# EAGLE design P2N15-001 (EAGLE 7.1.0)
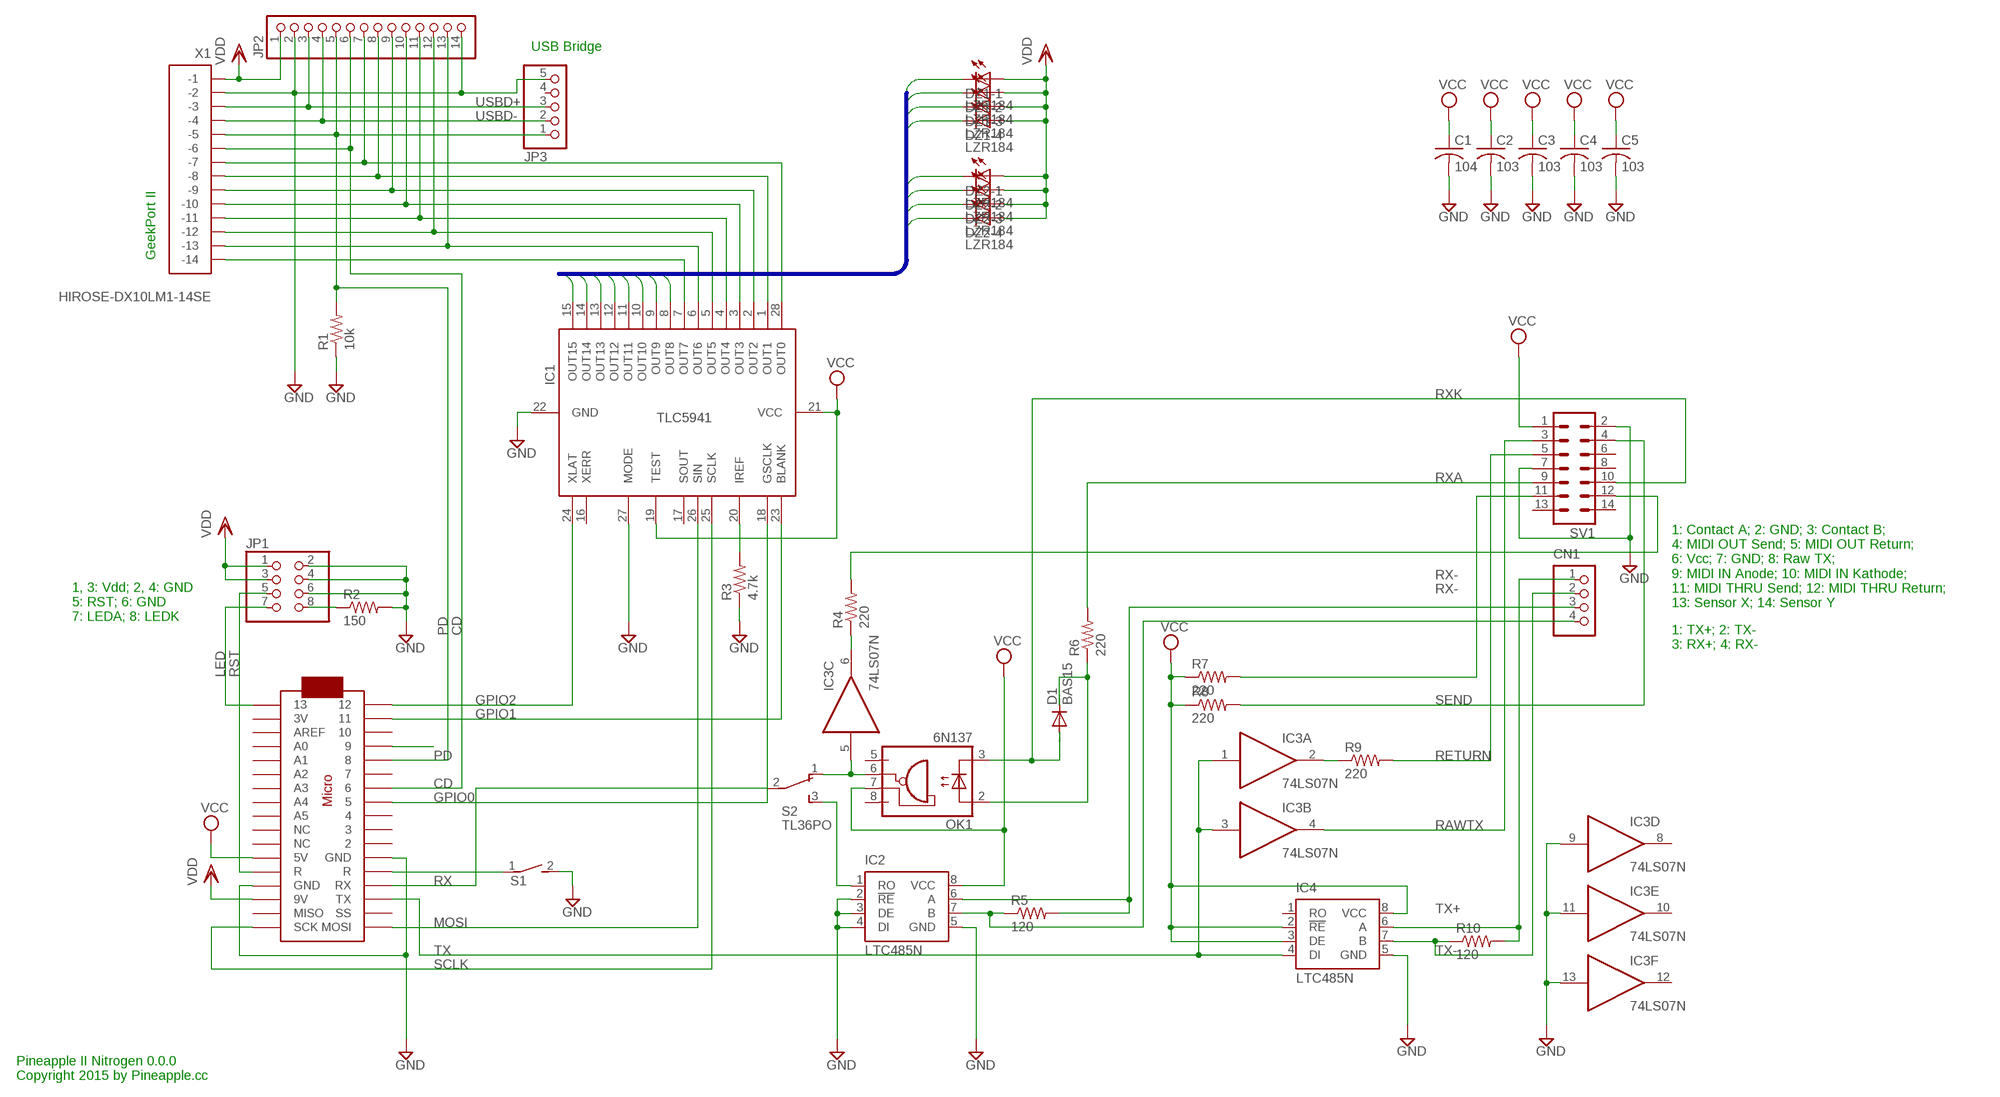
[diagram p0: schematic, sheet 1]

## Parts
C1  104  C-US025-025X050  [C025-025X050]
C2  103  C-US025-025X050  [C025-025X050]
C3  103  C-US025-025X050  [C025-025X050]
C4  103  C-US025-025X050  [C025-025X050]
C5  103  C-US025-025X050  [C025-025X050]
CN1  S4B-PH-K-S  [S4B-PH-K-S]
D1  BAS15  [DO34-7]
DZ1  LZR184  [LZR184]
DZ2  LZR184  [LZR184]
IC1  TLC5941NT  [DIL28-3]
IC2  LTC485N  [DIL08]
IC3  74LS07N  [DIL14]
IC4  LTC485N  [DIL08]
JP1  PINHD-2X4  [2X04]
JP2  PINHD-1X14  [1X14]
JP3  PINHD-1X5/90  [1X05/90]
MC1  ARDUINOMICRO  [ARDUINOMICRO]
OK1  6N137  [DIL08]
R1  10k  R-US_0204/5  [0204/5]
R2  150  R-US_0204/5  [0204/5]
R3  4.7k  R-US_0204/5  [0204/5]
R4  220  R-US_0204/5  [0204/5]
R5  120  R-US_0204/5  [0204/5]
R6  220  R-US_0204/5  [0204/5]
R7  220  R-US_0204/5  [0204/5]
R8  220  R-US_0204/5  [0204/5]
R9  220  R-US_0204/5  [0204/5]
R10  120  R-US_0204/5  [0204/5]
S1  DS01E  [DS-01]
S2  TL36PO  [TL3XPO]
SV1  ML14L  [ML14L]
X1  HIROSE-DX10LM1-14SE  [HIROSE-DX10LM1-14SE]

## Nets
ANLG0: IC1.1(OUT1) JP2.8 X1.P$8(-8)
ANLG1: IC1.2(OUT2) JP2.9 X1.P$9(-9)
ANLG2: IC1.3(OUT3) JP2.10 X1.P$10(-10)
ANLG3: IC1.4(OUT4) JP2.11 X1.P$11(-11)
CD: JP2.6 MC1.P$7 X1.P$6(-6)
GND: C1.2 C2.2 C3.2 C4.2 C5.2 IC1.22(GND) IC1.27(MODE) IC2.2(!RE) IC2.3(DE) IC2.4(DI) IC2.5(GND) IC3.9(D:I) IC3.11(E:I) IC3.13(F:I) IC4.5(GND) JP1.2 JP1.4 JP1.6 JP2.2 JP2.14 JP3.5 MC1.P$12(GND) MC1.P$21(GND) R1.1 R2.2 R3.1 S1.2 SV1.2 SV1.7 X1.P$2(-2)
GPIO0: IC1.18(GSCLK) MC1.P$8
GPIO1: IC1.23(BLANK) MC1.P$2
GPIO2: IC1.24(XLAT) MC1.P$1
LED: JP1.7 MC1.P$34
LED0: DZ1.K1(-1:C) IC1.8(OUT8)
LED1: DZ1.K2(-2:C) IC1.9(OUT9)
LED2: DZ1.K3(-3:C) IC1.10(OUT10)
LED3: DZ1.K4(-4:C) IC1.11(OUT11)
LED4: DZ2.K1(-1:C) IC1.12(OUT12)
LED5: DZ2.K2(-2:C) IC1.13(OUT13)
LED6: DZ2.K3(-3:C) IC1.14(OUT14)
LED7: DZ2.K4(-4:C) IC1.15(OUT15)
MIDIRX: IC3.5(C:I) OK1.6(VO) S2.1(O)
MOSI: IC1.26(SIN) MC1.P$17(MOSI)
N$1: IC1.28(OUT0) JP2.7 X1.P$7(-7)
N$2: IC3.2(A:O) R9.1
N$3: MC1.P$4
N$4: IC1.20(IREF) R3.2
N$5: MC1.P$22(R) S1.1
N$6: IC3.6(C:O) R4.1
N$7: R7.2 SV1.11
N$8: IC1.7(OUT7) X1.P$14(-14)
N$10: R4.2 SV1.12
N$15: D1.C OK1.2(A) R6.1
N$28: IC1.5(OUT5) JP2.12 X1.P$12(-12)
N$29: IC1.6(OUT6) JP2.13 X1.P$13(-13)
N$32: JP1.8 R2.1
PD: JP2.5 JP3.1 MC1.P$5 R1.2 X1.P$5(-5)
RAWTX: IC3.4(B:O) SV1.3
RETURN: R9.2 SV1.5
RST: JP1.5 MC1.P$13(R)
RX: MC1.P$14(RX) S2.2(P)
RX+: CN1.3 IC2.6(A) R5.2
RX-: CN1.4 IC2.7(B) R5.1
RXA: R6.2 SV1.9
RXK: D1.A OK1.3(C) SV1.10
SCLK: IC1.25(SCLK) MC1.P$18(SCK)
SEND: R8.2 SV1.4
TX: IC3.1(A:I) IC3.3(B:I) IC4.4(DI) MC1.P$15(TX)
TX+: CN1.1 IC4.6(A) R10.2
TX-: CN1.2 IC4.7(B) R10.1
USBD+: JP2.3 JP3.3 X1.P$3(-3)
USBD-: JP2.4 JP3.2 X1.P$4(-4)
VCC: C1.1 C2.1 C3.1 C4.1 C5.1 IC1.19(TEST) IC1.21(VCC) IC2.8(VCC) IC4.2(!RE) IC4.3(DE) IC4.8(VCC) MC1.P$23(5V) OK1.7(VE) R7.1 R8.1 SV1.1
VDD: DZ1.A1(-1:A) DZ1.A2(-2:A) DZ1.A3(-3:A) DZ1.A4(-4:A) DZ2.A1(-1:A) DZ2.A2(-2:A) DZ2.A3(-3:A) DZ2.A4(-4:A) JP1.1 JP1.3 JP2.1 MC1.P$20(9V) X1.P$1(-1)
XMIDIRX: IC2.1(RO) S2.3(S)
Unconnected: IC1.16(XERR) IC1.17(SOUT) IC3.8(D:O) IC3.10(E:O) IC3.12(F:O) IC4.1(RO) JP3.4 MC1.P$3 MC1.P$6 MC1.P$9 MC1.P$10 MC1.P$11 MC1.P$16(SS) MC1.P$19(MISO) MC1.P$24(NC) MC1.P$25(NC) MC1.P$26(A5) MC1.P$27(A4) MC1.P$28(A3) MC1.P$29(A2) MC1.P$30(A1) MC1.P$31(A0) MC1.P$32(AREF) MC1.P$33(3V) OK1.5(GND) OK1.8(VCC) SV1.6 SV1.8 SV1.13 SV1.14

## Buses
LED[0..7]

## Notes on the sheet
- USB Bridge
- GeekPort II
- 1: Contact A; 2: GND; 3: Contact B;
  4: MIDI OUT Send; 5: MIDI OUT Return;
  6: Vcc; 7: GND; 8: Raw TX;
  9: MIDI IN Anode; 10: MIDI IN Kathode;
  11: MIDI THRU Send; 12: MIDI THRU Return;
  13: Sensor X; 14: Sensor Y
- 1, 3: Vdd; 2, 4: GND
  5: RST; 6: GND
  7: LEDA; 8: LEDK
- 1: TX+; 2: TX-
  3: RX+; 4: RX-
- Pineapple II Nitrogen 0.0.0
  Copyright 2015 by Pineapple.cc

## Power pins joined to a net without a drawn wire
GND: IC3.7(P:GND)
VCC: IC3.14(P:VCC)

## Library data of the parts
C1-C5 = rcl:C-US: CAPACITOR, American symbol
CN1 = jst-ph:S4B-PH-*: Wire-to-Board 2.0mm pitch side mount connector Source: http://www.jst-mfg.com/product/pdf/jpn/PH.pdf http://www.jst-mfg.com/product/detail.php?series=199
D1 = diode:BAS15: DIODE high speed
DZ1 DZ2 = led:LZR184: LED BLOCK 4 LEDs, Siemens
IC1 = adafruit:TLC5941
IC2 IC4 = linear-technology:LTC485: Low Power RS485 Interface Transceiver Source: http://www.linear.com/pc/downloadDocument.do?navId=H0,C1,C1007,C1017,P2064,D1718; OC_FARNELL: unknown; OC_NEWARK: unknown
IC3 = 74xx-us:74*07: Hex BUFFER, open collector high-voltage output
JP1 = pinhead:PINHD-2X4: PIN HEADER
JP2 = pinhead:PINHD-1X14: PIN HEADER
JP3 = pinhead:PINHD-1X5: PIN HEADER
MC1 = adafruit:ARDUINOMICRO
OK1 = optocoupler:6N137: MOTOROLA OPTO COUPLER; MPN: 6N137; OC_FARNELL: 1328376; OC_NEWARK: 52M1895
R1-R10 = resistor:R-US_: RESISTOR, American symbol
S1 = switch-dil:DS01E: DIL/CODE SWITCH; OC_FARNELL: unknown; OC_NEWARK: unknown
S2 = switch:TL36PO: TINY SWITCH ON - ON Source: http://www2.produktinfo.conrad.com/datenblaetter/700000-724999/705152-da-01-de-Subminiaturschalter_TL_36YO.pdf
SV1 = con-ml:ML14L: HARTING; OC_FARNELL: unknown; OC_NEWARK: unknown
X1 = con-hirose-dx10lm1-14se:HIROSE-DX10LM1-14SE: AXR30545 Plug (Board mounting type) B type Source: http://www.panasonic-electric-works.ch/home/www/catalogues/connector/download/en_ds_65201_0000.pdf; MPN: AXR30545; OC_FARNELL: unknown; OC_NEWARK: 11N4069

## Board
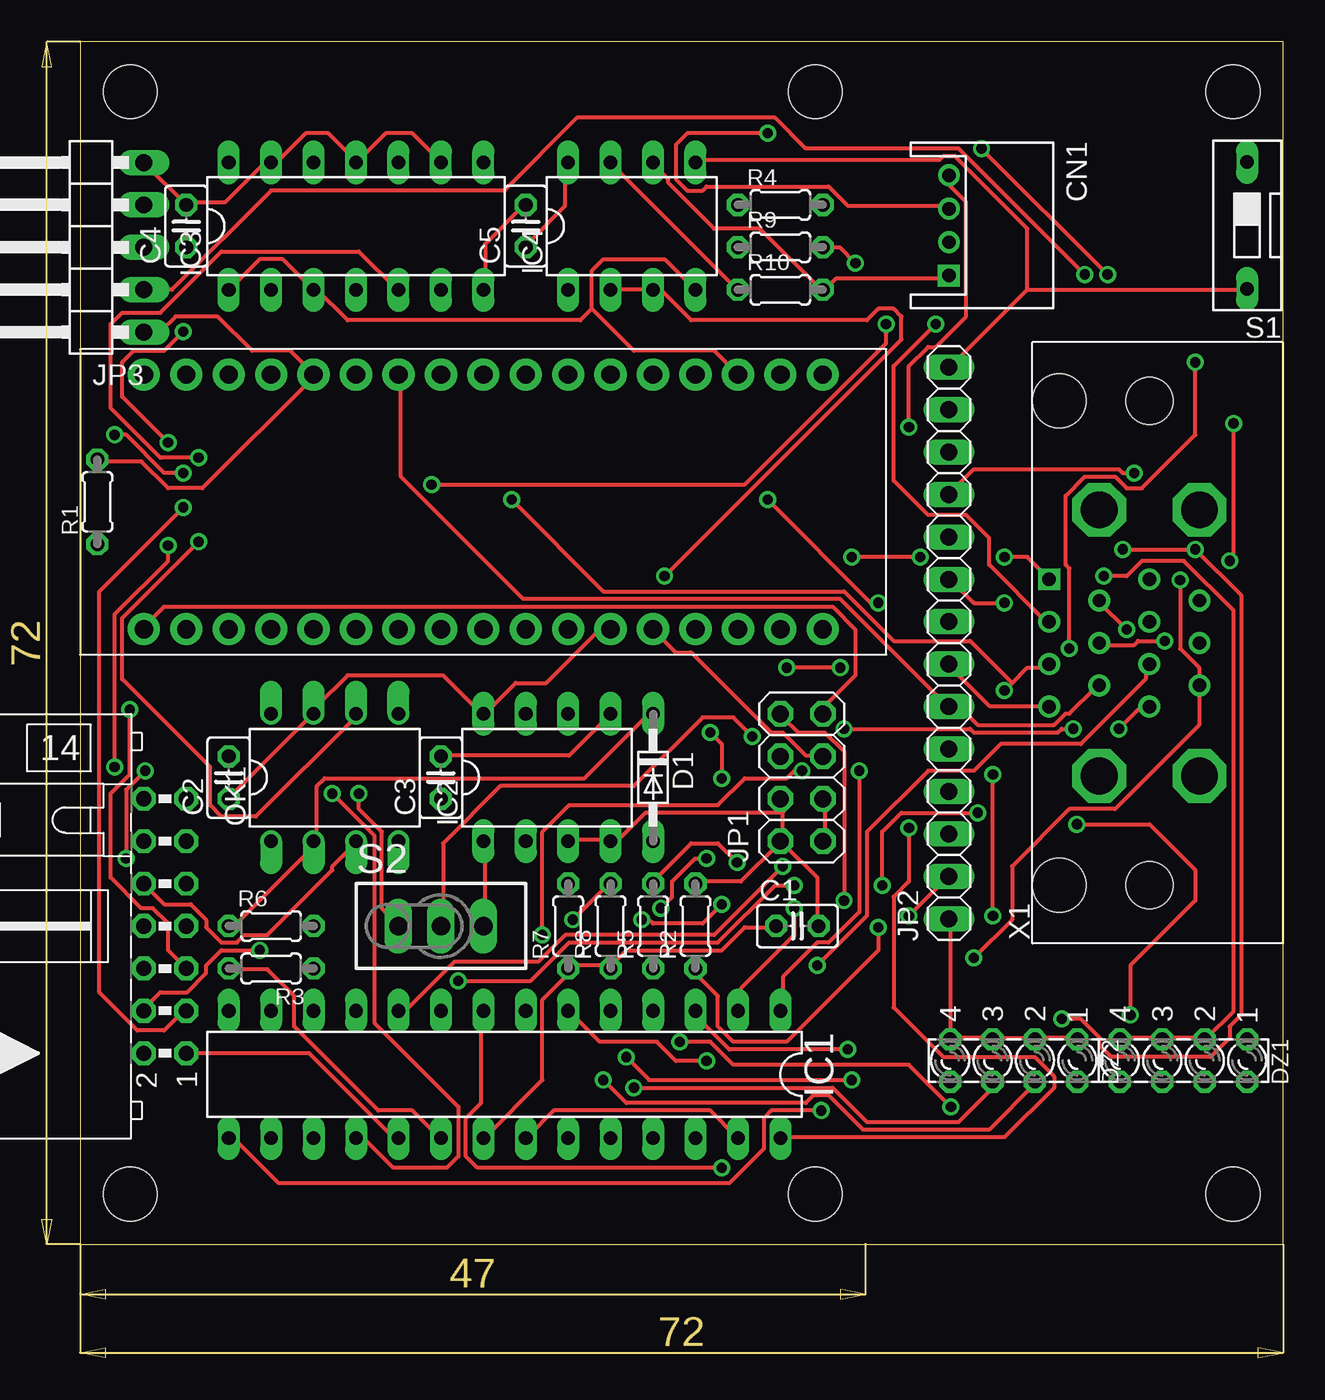
[diagram p1: board, top side]
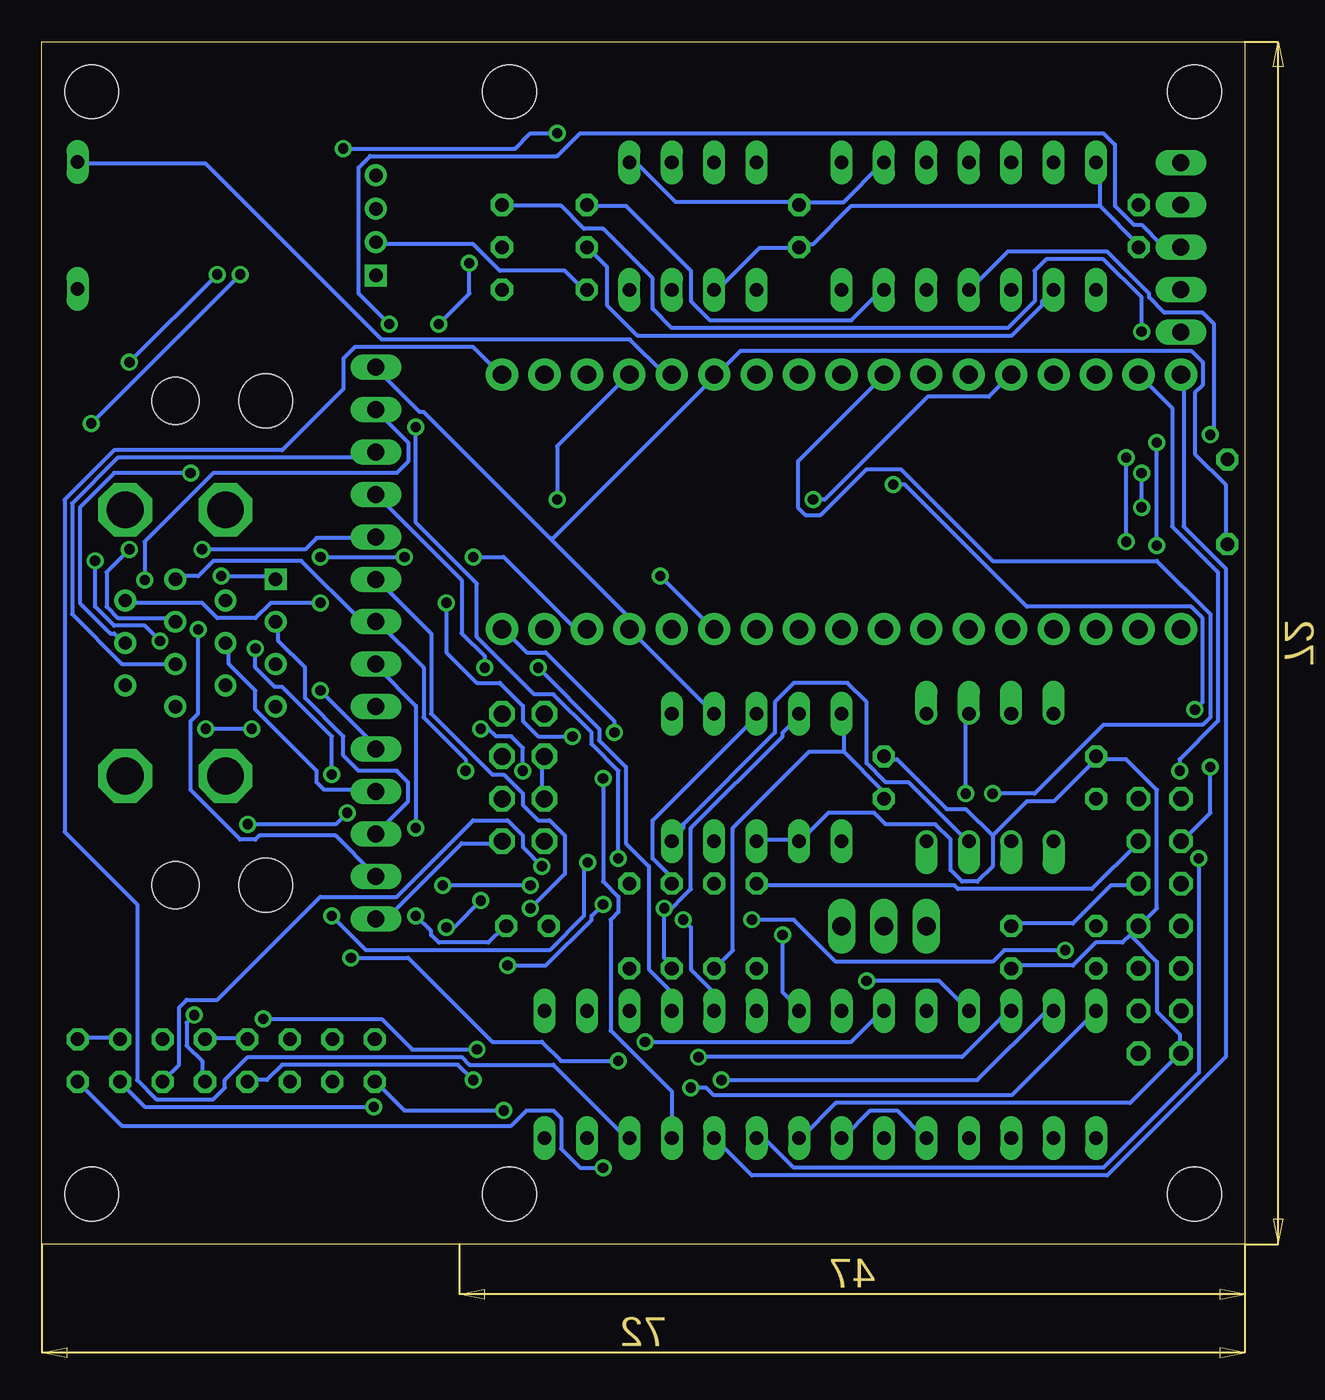
[diagram p2: board, bottom side, seen from below]

Size 72 x 72 mm. Coordinates in mm from the lower left corner, seen from the top.
Outline: 0,0 72,0 72,72 0,72 0,0
Copper layers (1*16): Top 0.035mm / dielectric 1.5mm / Bottom 0.035mm
Design rules "default": minimum track width 10mil, minimum drill 24mil, track to track 8mil, track to pad 8mil, pad to pad 8mil, via to via 8mil, smd to smd 8mil, copper to edge 40mil, drill to drill 8mil, minimum pad ring 10mil, minimum via ring 8mil, stop-mask expansion 4mil, vias tented up to drill 0mil, thermal gap 10mil
Holes 3.2 mm at 3,3 3,69 69,3 69,69 44,3 44,69

### Footprints (pad centres in the part's own frame; a part is rotated, then mirrored left to right if it is on the bottom)
C025-025X050 = drill 0.813 octagon: 1 -1.27,0; 2 1.27,0
S4B-PH-K-S = drill 0.8 square: 1 3,0 | drill 0.8: 2 1,0; 3 -1,0; 4 -3,0
DO34-7 = drill 0.813 long: A 3.81,0; C -3.81,0
LZR184 = drill 0.813 octagon: A1 -1.27,3.81; A2 -1.27,1.27; A3 -1.27,-1.27; A4 -1.27,-3.81; K1 1.27,3.81; K2 1.27,1.27; K3 1.27,-1.27; K4 1.27,-3.81
DIL28-3 = drill 0.813 long: 1 -16.51,-3.81; 2 -13.97,-3.81; 3 -11.43,-3.81; 4 -8.89,-3.81; 5 -6.35,-3.81; 6 -3.81,-3.81; 7 -1.27,-3.81; 8 1.27,-3.81; 9 3.81,-3.81; 10 6.35,-3.81; 11 8.89,-3.81; 12 11.43,-3.81; 13 13.97,-3.81; 14 16.51,-3.81; 15 16.51,3.81; 16 13.97,3.81; 17 11.43,3.81; 18 8.89,3.81; 19 6.35,3.81; 20 3.81,3.81; 21 1.27,3.81; 22 -1.27,3.81; 23 -3.81,3.81; 24 -6.35,3.81; 25 -8.89,3.81; 26 -11.43,3.81; 27 -13.97,3.81; 28 -16.51,3.81
DIL08 = drill 0.813 long: 1 -3.81,-3.81; 2 -1.27,-3.81; 3 1.27,-3.81; 4 3.81,-3.81; 5 3.81,3.81; 6 1.27,3.81; 7 -1.27,3.81; 8 -3.81,3.81
DIL14 = drill 0.813 long: 1 -7.62,-3.81; 2 -5.08,-3.81; 3 -2.54,-3.81; 4 0,-3.81; 5 2.54,-3.81; 6 5.08,-3.81; 7 7.62,-3.81; 8 7.62,3.81; 9 5.08,3.81; 10 2.54,3.81; 11 0,3.81; 12 -2.54,3.81; 13 -5.08,3.81; 14 -7.62,3.81
2X04 = drill 1.016 octagon: 1 -3.81,-1.27; 2 -3.81,1.27; 3 -1.27,-1.27; 4 -1.27,1.27; 5 1.27,-1.27; 6 1.27,1.27; 7 3.81,-1.27; 8 3.81,1.27
1X14 = drill 1.016 long: 1 -16.51,0; 2 -13.97,0; 3 -11.43,0; 4 -8.89,0; 5 -6.35,0; 6 -3.81,0; 7 -1.27,0; 8 1.27,0; 9 3.81,0; 10 6.35,0; 11 8.89,0; 12 11.43,0; 13 13.97,0; 14 16.51,0
1X05/90 = drill 1.016 long: 1 -5.08,-3.81; 2 -2.54,-3.81; 3 0,-3.81; 4 2.54,-3.81; 5 5.08,-3.81
ARDUINOMICRO = drill 1.1 pad 1.93: P$1 -20.32,7.62; P$2 -17.78,7.62; P$3 -15.24,7.62; P$4 -12.7,7.62; P$5 -10.16,7.62; P$6 -7.62,7.62; P$7 -5.08,7.62; P$8 -2.54,7.62; P$9 0,7.62; P$10 2.54,7.62; P$11 5.08,7.62; P$12 12.7,-7.62; P$13 10.16,-7.62; P$14 12.7,7.62; P$15 15.24,7.62; P$16 17.78,7.62; P$17 20.32,7.62; P$18 20.32,-7.62; P$19 17.78,-7.62; P$20 15.24,-7.62; P$21 7.62,7.62; P$22 10.16,7.62; P$23 7.62,-7.62; P$24 5.08,-7.62; P$25 2.54,-7.62; P$26 0,-7.62; P$27 -2.54,-7.62; P$28 -5.08,-7.62; P$29 -7.62,-7.62; P$30 -10.16,-7.62; P$31 -12.7,-7.62; P$32 -15.24,-7.62; P$33 -17.78,-7.62; P$34 -20.32,-7.62
DIL08' = drill 0.813 offset: 1 -3.81,-3.81; 2 -1.27,-3.81; 3 1.27,-3.81; 4 3.81,-3.81; 5 3.81,3.81; 6 1.27,3.81; 7 -1.27,3.81; 8 -3.81,3.81
0204/5 = drill 0.813 octagon: 1 -2.54,0; 2 2.54,0
DS-01 = drill 0.813 long: 1 0,-3.81; 2 0,3.81
TL3XPO = drill 1.1 pad 1.422 long: 1 -2.54,0; 2 0,0; 3 2.54,0
ML14L = drill 0.914 octagon: 1 -7.62,-1.27; 2 -7.62,1.27; 3 -5.08,-1.27; 4 -5.08,1.27; 5 -2.54,-1.27; 6 -2.54,1.27; 7 0,-1.27; 8 0,1.27; 9 2.54,-1.27; 10 2.54,1.27; 11 5.08,-1.27; 12 5.08,1.27; 13 7.62,-1.27; 14 7.62,1.27
HIROSE-DX10LM1-14SE = drill 0.8 square: P$1 3.81,9 | drill 0.8: P$2 2.54,6; P$3 1.27,9; P$4 0,6; P$5 -1.27,9; P$6 -2.54,6; P$7 -3.81,9; P$8 3.81,3; P$9 2.54,0; P$10 1.27,3; P$11 0,0; P$12 -1.27,3; P$13 -2.54,0; P$14 -3.81,3 | drill 2.2 octagon: P$15 -7.97,0; P$16 7.97,0; P$17 7.97,6; P$18 -7.97,6 | hole 2.8: -14.5,3; 14.5,3 | hole 3.2: -14.5,8.4; 14.5,8.4

### Placement (x,y rotation side)
C1  42.93,19.05 0 top
C2  8.89,27.94 90 top
C3  21.59,27.94 90 top
C4  6.35,60.96 90 top
C5  26.67,60.96 90 top
CN1  52,61 270 top
D1  34.29,27.94 270 top
DZ1  66.04,11 270 top
DZ2  55.88,11 270 top
IC1  25.4,10.16 180 top
IC2  27.94,27.94 0 top
IC3  16.51,60.96 0 top
IC4  33.02,60.96 0 top
JP1  43.18,27.94 90 top
JP2  52,36 90 top
JP3  0,59.69 90 top
MC1  24.13,44.45 0 top
OK1  6N137  [DIL08']  15.24,27.94 0 top
R1  1.03,44.45 90 top
R2  36.83,19.05 90 top
R3  11.43,16.51 180 top
R4  41.91,62.23 0 top
R5  34.29,19.05 90 top
R6  11.43,19.05 0 top
R7  29.21,19.05 90 top
R8  31.75,19.05 90 top
R9  41.91,59.69 0 top
R10  41.91,57.15 0 top
S1  69.85,61 180 top
S2  21.59,19.05 0 top
SV1  5.08,19.05 90 top
X1  67,36 90 top

### Tracks (layer width: path | path; a pad name or v marks a point on that pad's centre or on a via)
ANLG0  (via drill 0.61)
  Top 0.254: v46.63,28.35 46.63,19.89 44.81,18.06 44.12,18.06 42.06,16 42.06,14.17 IC1.1
  Bottom 0.254: X1.P$8 63.78,40.01 62.64,40.01 61.72,40.92 56.46,40.92 53.03,37.49 52.12,37.49 JP2.8 51.89,37.26 49.15,34.52 49.15,31.55 46.63,29.03 v46.63,28.35
ANLG1  (via drill 0.61)
  Top 0.254: v55.32,38.41 53.49,38.41 52.12,39.78 JP2.9 | v42.75,20.12 42.75,18.52 39.55,15.32 39.55,14.17 IC1.2
  Bottom 0.254: v55.32,38.41 58.29,38.41 59.21,37.49 61.49,37.49 62.41,38.41 66.98,38.41 X1.P$9 | v42.75,20.12 40.69,22.17 40.69,24.46 41.6,25.38 42.29,25.38 43.2,26.29 43.2,26.98 44.35,28.12 45.03,28.12 48.69,31.77 48.69,36.58 51.89,39.78 JP2.9
ANLG2  (via drill 0.61)
  Top 0.254: v62.41,41.6 v66.75,41.6 69.49,38.86 69.49,13.72 68.81,13.03 68.81,12.34 67.67,11.2 61.72,11.2 61.04,11.89 61.04,12.34 59.89,13.49 v58.75,13.49 | v45.95,11.66 38.86,11.66 37.03,13.49 37.03,13.95 IC1.3
  Bottom 0.254: v66.75,41.6 68.12,40.23 68.12,38.18 67.44,37.49 64.01,37.49 X1.P$10 | v62.41,41.6 56.24,41.6 55.55,42.29 52.12,42.29 JP2.10 | v45.95,11.66 49.84,11.66 51.66,13.49 v58.75,13.49
ANLG3  (via drill 0.61)
  Top 0.254: v63.09,46.18 62.41,46.18 62.18,46.41 53.49,46.41 52.12,45.03 JP2.11 | v45.49,34.52 v42.29,34.52
  Bottom 0.254: v63.09,46.18 67.67,46.18 69.72,44.12 69.72,38.41 67.89,36.58 67.67,36.58 67.21,36.12 X1.P$11 | IC1.4 34.29,15.09 35.66,16.46 35.66,22.63 37.03,24 37.03,28.57 38.63,30.18 38.63,30.86 v42.29,34.52 | v45.49,34.52 45.49,35.2 46.86,36.58 46.86,39.78 51.89,44.81 JP2.11
CD
  Top 0.254: X1.P$6 60.81,33.38 59.21,31.77 58.98,31.77 58.29,31.09 53.72,31.09 52.81,32 52.12,32 JP2.6 51.89,32.23 45.49,38.63 26.52,38.63 19.2,45.95 19.2,51.89 MC1.P$7
GND  (via drill 0.61)
  Top 0.254: v62.64,36.8 61.04,38.41 X1.P$2 | IC2.3 29.26,24.23 31.55,24.23 IC2.4 31.77,24.23 32.23,24.23 33.83,25.83 42.06,25.83 | R2.2 37.03,21.72 39.55,21.72 41.83,24 JP1.2 | C1.2 44.12,19.2 44.12,21.95 42.06,24 JP1.2 | 42.06,25.83 42.06,24.23 JP1.2 | 42.06,25.83 42.06,26.52 JP1.4 | v49.61,19.66 51.89,21.95 JP2.2 | IC1.27 37.72,8 28.35,8 26.75,6.4 IC1.22 | JP3.5 C4.2 6.4,62.41 8.69,62.41 10.97,64.69 11.43,64.69 IC3.13 11.43,64.92 11.89,64.92 13.49,66.52 14.86,66.52 16.46,64.92 IC3.11 16.69,64.92 18.29,66.52 19.89,66.52 21.49,64.92 IC3.9 | IC3.7 24.23,57.15 24.23,59.89 26.52,62.18 C5.2 | 56.69,57.15 69.72,57.15 S1.2 | 56.69,57.15 52.12,52.58 JP2.14 | IC2.5 29.26,29.26 21.72,29.26 C3.2 | 56.69,57.15 56.69,60.81 52.35,65.15 51.66,65.15 51.44,64.92 37.03,64.92 IC4.5
  Bottom 0.254: v62.64,36.8 62.64,31.77 63.09,31.32 63.09,27.2 60.12,24.23 59.21,24.23 58.98,24.46 54.41,24.46 52.12,22.17 JP2.2 | IC2.3 29.03,24.23 26.75,24.23 IC2.2 26.52,24.23 24.92,25.83 22.17,25.83 21.49,25.15 18.52,25.15 17.6,24.23 17.6,22.4 16.92,21.72 16,21.72 15.09,22.63 15.09,24.46 | JP1.4 42.06,26.75 42.06,29.03 JP1.6 | v49.61,19.66 48.69,18.75 48.69,18.52 48.23,18.06 45.26,18.06 44.35,18.97 C1.2 | 6.86,18.52 6.4,18.97 SV1.7 6.17,19.2 5.26,20.12 5.26,27.2 7.09,29.03 8.69,29.03 C2.2 8.91,29.03 11.43,26.52 13.03,26.52 15.09,24.46 | 6.86,18.52 7.32,18.06 8.91,18.06 10.29,16.69 13.95,16.69 R3.1 | 3.89,11.43 3.89,12.57 5.26,13.95 5.26,16.92 6.86,18.52 | 3.89,11.43 6.86,8.46 24.46,8.46 26.52,6.4 IC1.22 | 3.89,11.43 SV1.2 | R1.1 1.14,42.06 1.14,45.49 2.97,47.32 2.97,50.98 2.52,51.44 2.52,52.81 3.2,53.49 30.18,53.49 31.55,52.12 MC1.P$21 31.77,51.89 41.38,42.29 41.6,42.29 | IC4.5 36.8,64.69 36.35,64.69 34.06,62.41 26.75,62.41 C5.2 26.52,62.41 24,62.41 21.72,64.69 IC3.9 | IC2.5 MC1.P$12 37.03,37.03 37.03,37.72 41.6,42.29 | 41.6,42.29 49.15,49.84 49.38,49.84 51.89,52.35 JP2.14 | 15.09,24.46 16.69,26.06 17.83,26.06 20.8,29.03 21.49,29.03 C3.2
GPIO0  (via drill 0.61)
  Top 0.254: v15.09,26.98 17.6,24.46 17.6,13.26 22.63,8.23 22.63,5.26 21.95,4.57 18.75,4.57 17.14,6.17 16.69,6.17 IC1.18
  Bottom 0.254: v15.09,26.98 12.57,26.98 8.46,31.09 2.52,31.09 2.06,31.55 2.06,37.72 5.26,40.92 15.09,40.92 20.57,46.41 22.63,46.41 25.38,43.66 26.29,43.66 26.75,44.12 26.75,46.86 21.72,51.89 MC1.P$8
GPIO1  (via drill 0.61)
  Top 0.254: v2.74,23.09 2.74,27.2 v3.89,28.35
  Bottom 0.254: v2.74,23.09 2.74,10.29 8.46,4.57 26.98,4.57 28.57,6.17 29.03,6.17 IC1.23 | v3.89,28.35 3.89,29.03 1.6,31.32 1.6,40.23 4.34,42.98 4.34,50.06 MC1.P$2
GPIO2
  Bottom 0.254: IC1.24 31.55,6.17 29.49,4.12 8.23,4.12 1.14,11.2 1.14,40.46 3.66,42.98 3.66,51.89 MC1.P$1
LED
  Top 0.254: JP1.7 44.58,31.77 44.58,32.23 46.41,34.06 46.41,36.8 45.03,38.18 5.03,38.18 3.89,37.03 MC1.P$34
LED0  (via drill 0.61)
  Top 0.254: v38.41,4.57 23.77,4.57 23.09,5.26 23.09,7.54 24,8.46 24,13.95 IC1.8
  Bottom 0.254: v38.41,4.57 39.78,4.57 40.92,5.71 40.92,7.54 41.38,8 42.98,8 43.89,7.09 67.21,7.09 69.72,9.6 DZ1.K1
LED1  (via drill 0.61)
  Top 0.254: v35.89,12.12 37.72,12.12 39.09,10.74 49.61,10.74 v52.12,8.23
  Bottom 0.254: v35.89,12.12 23.55,12.12 21.72,13.95 IC1.9 | v52.12,8.23 65.84,8.23 67.21,9.6 DZ1.K2
LED2  (via drill 0.61)
  Top 0.254: v42.06,22.63 37.95,18.52 29.03,18.52 27.43,16.92 22.4,16.92 19.66,14.17 19.2,14.17 IC1.10
  Bottom 0.254: v42.06,22.63 43.2,23.77 43.2,24.46 44.12,25.38 46.18,25.38 50.75,20.8 55.32,20.8 61.49,14.63 63.32,14.63 63.78,14.17 63.78,10.74 64.69,9.83 DZ1.K3
LED3  (via drill 0.61)
  Top 0.254: v62.87,13.72 62.87,16.69 66.75,20.57 66.75,22.4 64.01,25.15 v59.66,25.15 | v53.72,25.83 49.15,25.83 48.01,24.69 v48.01,21.49 | v42.75,21.49 41.6,21.49 38.18,18.06 29.26,18.06 26.98,15.77 v22.63,15.77
  Bottom 0.254: v62.87,13.72 63.32,13.26 63.32,11.89 62.41,10.97 62.41,9.83 DZ1.K4 | v59.66,25.15 54.41,25.15 v53.72,25.83 | v42.75,21.49 v48.01,21.49 | v22.63,15.77 18.29,15.77 16.69,14.17 IC1.11
LED4  (via drill 0.61)
  Top 0.254: v46.18,9.83 34.06,9.83 v32.69,11.2
  Bottom 0.254: v46.18,9.83 47.09,10.74 57.61,10.74 58.52,9.83 59.66,9.83 DZ2.K1 | v32.69,11.2 16.92,11.2 14.17,13.95 IC1.12
LED5  (via drill 0.61)
  Top 0.254: v31.32,9.83 32.69,8.46 43.43,8.46 43.89,8.91 44.81,8.91 46.86,6.86 54.41,6.86 57.15,9.6 DZ2.K2
  Bottom 0.254: v31.32,9.83 16,9.83 11.89,13.95 11.43,13.95 IC1.13
LED6  (via drill 0.61)
  Top 0.254: v33.15,9.37 45.03,9.37 47.09,7.32 52.58,7.32 54.41,9.14 54.41,9.6 DZ2.K3
  Bottom 0.254: v33.15,9.37 32.23,9.37 31.77,8.91 13.95,8.91 IC1.14
LED7  (via drill 0.61)
  Top 0.254: v44.35,8 41.38,8 40.92,7.54 40.92,5.71 38.86,3.66 11.89,3.66 9.37,6.17 8.91,6.17 IC1.15
  Bottom 0.254: v44.35,8 50.29,8 51.89,9.6 DZ2.K4
MIDIRX  (via drill 0.61)
  Top 0.254: v16.69,26.98 16.69,26.06 18.06,24.69 18.06,20.12 18.97,19.2 S2.1 | v7.09,47.09 4.8,47.09 1.83,50.06 1.83,55.09 2.52,55.78 4.8,55.78 8.46,59.44 16.69,59.44 18.97,57.15 IC3.5 | v7.09,42.06 2.52,37.49 2.52,33.83 7.77,28.57 7.77,26.29 8.46,25.6 10.52,25.6 16.46,31.55 OK1.6
  Bottom 0.254: v16.69,26.98 16.69,31.55 OK1.6 | v7.09,42.06 v7.09,47.09
MOSI
  Bottom 0.254: IC1.26 37.03,6.4 41.38,10.74 46.41,10.74 46.86,11.2 59.66,11.2 61.04,9.83 61.04,9.37 61.72,8.69 65.15,8.69 66.29,9.83 66.29,20.34 70.64,24.69 70.64,44.58 67.67,47.55 57.61,47.55 53.95,51.21 53.95,53.03 53.26,53.72 46.18,53.72 44.58,52.12 MC1.P$17
N$1  (via drill 0.61)
  Top 0.254: X1.P$7 57.84,32.23 54.41,32.23 52.12,34.52 JP2.7 | v49.61,24.92 49.61,21.72 48.69,20.8 48.69,14.17 51.66,11.2 57.15,11.2 58.29,10.06 58.29,9.37 55.32,6.4 42.06,6.4 IC1.28
  Bottom 0.254: v49.61,24.92 49.61,32.23 51.89,34.52 JP2.7
N$2
  Bottom 0.254: IC3.2 12.12,56.46 12.12,56.24 13.95,54.41 36.35,54.41 38.18,56.24 38.18,58.52 39.32,59.66 R9.1
N$4
  Top 0.254: R3.2 8.91,16.46 11.2,16.46 12.8,14.86 12.8,13.03 17.83,8 19.89,8 21.49,6.4 IC1.20
N$5
  Bottom 0.254: S1.1 69.72,64.69 62.18,64.69 51.66,54.18 36.8,54.18 34.75,52.12 34.29,52.12 MC1.P$22
N$6
  Bottom 0.254: IC3.6 21.72,57.15 23.55,55.32 32,55.32 33.15,56.46 33.15,58.29 37.03,62.18 39.32,62.18 R4.1
N$7
  Bottom 0.254: R7.2 29.03,21.49 17.37,21.49 17.14,21.26 9.14,21.26 6.4,24 SV1.11
N$8  (via drill 0.61)
  Top 0.254: v62.18,30.86 63.32,32 63.78,32 X1.P$14 | v59.44,30.86 58.75,30.86 58.52,30.63 53.49,30.63 53.26,30.86 v45.72,30.86 | v43.2,28.35 42.75,28.35 42.29,27.89 39.78,27.89 38.18,26.29 29.26,26.29 27.66,24.69 v27.66,18.52
  Bottom 0.254: v59.44,30.86 v62.18,30.86 | v45.72,30.86 45.26,30.86 44.81,30.4 43.89,30.4 43.2,29.72 v43.2,28.35 | v27.66,18.52 27.66,15.09 26.75,14.17 IC1.7
N$10  (via drill 0.61)
  Top 0.254: v6.17,54.63 5.03,53.49 3.2,53.49 2.52,52.81 2.52,50.75 v5.26,48.01 | v5.26,41.83 5.26,40.92 2.06,37.72 v2.06,28.57
  Bottom 0.254: v6.17,54.63 6.17,56.69 8.46,58.98 11.89,58.98 12.57,58.29 12.57,56.46 14.17,54.86 34.29,54.86 35.43,56.01 35.43,57.84 38.41,60.81 39.55,60.81 40.92,62.18 44.35,62.18 R4.2 | v5.26,41.83 v5.26,48.01 | v2.06,28.57 2.06,25.83 3.66,24.23 SV1.12
N$15
  Top 0.254: R6.1 8.91,19.2 9.37,19.2 14.17,24 OK1.2 14.17,24.23 14.17,27.43 14.63,27.89 30.18,27.89 33.83,31.55 34.29,31.55 D1.C
N$28  (via drill 0.61)
  Top 0.254: v33.6,19.43 34.06,19.43 34.29,19.2 37.26,19.2 v38.41,20.34 | v44.12,16.69 47.09,19.66 47.09,24.69 50.75,28.35 53.49,28.35 55.09,29.95 59.89,29.95 63.78,33.83 63.78,34.52 X1.P$12
  Bottom 0.254: X1.P$12 64.01,34.75 67.21,34.75 70.18,37.72 70.18,44.35 67.44,47.09 52.35,47.09 52.12,47.32 JP2.12 | v33.6,19.43 33.15,18.97 33.15,16.46 31.77,15.09 31.77,14.17 IC1.5 | v38.41,20.34 39.09,19.66 39.09,19.43 41.83,16.69 v44.12,16.69
N$29  (via drill 0.61)
  Top 0.254: v65.84,39.78 65.84,35.66 66.98,34.52 66.98,33.6 X1.P$13 66.98,33.38 66.98,31.09 61.95,26.06 59.21,26.06 55.78,22.63 55.78,19.43 v53.49,17.14 | v37.49,10.97 35.66,10.97 34.52,12.12 31.09,12.12 29.26,13.95 IC1.6
  Bottom 0.254: v65.84,39.78 65.84,42.06 61.72,46.18 50.75,46.18 50.06,46.86 50.06,48.01 51.89,49.84 JP2.13 | v37.49,10.97 40.92,10.97 42.06,12.12 45.03,12.12 50.06,17.14 v53.49,17.14
N$32  (via drill 0.61)
  Top 0.254: v47.78,18.97 47.78,17.6 42.29,12.12 39.09,12.12 38.18,13.03 38.18,14.86 37.03,16 37.03,16.46 R2.1 | v45.72,20.57 45.72,29.49 44.58,30.63 42.98,30.63 42.06,31.55 JP1.8
  Bottom 0.254: v47.78,18.97 47.32,18.97 v45.72,20.57
PD  (via drill 0.61)
  Top 0.254: v55.32,33.15 55.78,33.6 | 55.78,33.6 56.69,34.52 57.84,34.52 X1.P$5 | R1.2 1.14,46.86 3.66,46.86 5.26,45.26 7.32,45.26 13.95,51.89 MC1.P$5 13.95,52.12 12.57,53.49 10.29,53.49 8.23,55.55 5.71,55.55 4.8,54.63 3.89,54.63 JP3.1 | 55.78,33.6 53.26,36.12 48.69,36.12 45.72,39.09 31.32,39.09 v25.83,44.58
  Bottom 0.254: v55.32,33.15 51.89,29.72 JP2.5 | v25.83,44.58 25.15,44.58 18.97,50.75 15.32,50.75 14.17,51.89 MC1.P$5
RAWTX  (via drill 0.61)
  Top 0.254: v2.06,48.46 2.74,48.46 5.03,46.18 v6.17,46.18 | v6.17,44.12 1.14,39.09 1.14,15.09 3.43,12.8 5.03,12.8 6.17,13.95 SV1.3
  Bottom 0.254: v2.06,48.46 1.83,48.69 1.83,55.09 2.52,55.78 4.8,55.78 5.71,56.69 5.71,56.92 8.23,59.44 14.17,59.44 16.46,57.15 IC3.4 | v6.17,44.12 v6.17,46.18
RETURN  (via drill 0.61)
  Top 0.254: v46.41,58.75 45.49,59.66 44.58,59.66 R9.2 | v48.23,55.09 48.23,53.95 39.78,45.49 v21.03,45.49 | v2.97,32 2.97,28.12 1.83,26.98 1.83,21.95 3.66,20.12 4.34,20.12 5.26,19.2 5.26,17.6 SV1.5
  Bottom 0.254: v46.41,58.75 46.41,56.92 v48.23,55.09 | v21.03,45.49 20.34,45.49 13.03,38.18 3.2,38.18 2.52,37.49 2.52,32.46 v2.97,32
RST
  Top 0.254: JP1.5 44.35,29.26 43.43,29.26 42.06,30.63 41.38,30.63 36.58,35.43 35.66,35.43 34.29,36.8 MC1.P$13
RX  (via drill 0.61)
  Top 0.254: v40.23,30.4 39.09,31.55 37.26,31.55 33.15,27.43 25.15,27.43 21.72,24 21.72,19.2 S2.2 | v47.78,38.41 47.32,38.41 v41.15,44.58
  Bottom 0.254: v40.23,30.4 42.29,30.4 43.2,31.32 43.2,32.23 44.58,33.6 45.95,33.6 47.78,35.43 v47.78,38.41 | v41.15,44.58 41.15,47.78 37.03,51.89 MC1.P$14
RX+  (via drill 0.61)
  Top 0.254: v41.15,66.52 36.35,66.52 35.66,65.84 35.66,63.78 36.35,63.09 37.26,63.09 37.49,63.32 44.81,63.32 45.95,62.18 51.89,62.18 CN1.3 | v61.49,58.06 v53.95,65.61 | v66.75,52.81 66.75,48.46 63.55,45.26 62.64,45.26 61.95,45.95 60.12,45.95 58.98,44.81 58.98,40.69 59.21,40.46 v59.21,35.66 | v54.63,19.66 v54.63,28.12 | v39.32,22.86 38.18,24 36.58,24 34.29,21.72 R5.2
  Bottom 0.254: v41.15,66.52 42.75,66.52 43.66,65.61 v53.95,65.61 | v66.75,52.81 v61.49,58.06 | v59.21,35.66 59.21,34.52 58.06,33.38 57.61,33.38 54.63,30.4 v54.63,28.12 | v54.63,19.66 52.58,17.6 41.6,17.6 39.55,19.66 39.55,22.63 v39.32,22.86 | R5.2 34.29,21.95 35.43,23.09 35.43,25.38 29.26,31.55 IC2.6
RX-  (via drill 0.61)
  Top 0.254: v49.61,48.92 49.61,52.58 50.75,53.72 51.21,53.72 53.03,55.55 53.03,62.41 52.12,63.32 52.12,63.78 CN1.4 | v37.49,23.09 36.8,23.09 35.43,21.72 35.43,20.8 v34.75,20.12
  Bottom 0.254: v49.61,48.92 49.61,43.2 45.95,39.55 45.95,36.35 42.52,32.92 41.38,32.92 39.09,30.63 39.09,29.95 37.49,28.35 v37.49,23.09 | 34.75,19.66 34.75,17.14 34.29,16.69 R5.1 | 34.75,19.66 33.15,21.26 33.15,24.92 27.66,30.4 27.66,30.63 26.75,31.55 IC2.7 | 34.75,19.66 v34.75,20.12
RXA
  Bottom 0.254: R6.2 13.95,19.2 10.29,19.2 8,21.49 6.4,21.49 SV1.9
RXK
  Top 0.254: OK1.3 16.46,24 15.09,22.63 15.09,22.4 11.2,18.52 9.83,18.52 9.37,18.06 8.46,18.06 7.54,18.97 7.54,19.43 6.63,20.34 5.03,20.34 3.89,21.49 SV1.10
  Bottom 0.254: D1.A 34.29,24.23 33.6,24.92 33.6,25.15 28.12,30.63 28.12,32.46 26.98,33.6 23.77,33.6 22.63,32.46 22.63,28.8 21.49,27.66 20.12,27.66 16.69,24.23 OK1.3
SCLK  (via drill 0.61)
  Top 0.254: v38.41,27.89 38.41,29.95 v37.72,30.63
  Bottom 0.254: IC1.25 34.29,9.14 37.95,12.8 37.95,19.43 37.49,19.89 37.49,20.8 38.41,21.72 v38.41,27.89 | v37.72,30.63 37.72,31.32 41.83,35.43 42.98,35.43 44.35,36.8 MC1.P$18
SEND  (via drill 0.61)
  Top 0.254: v29.49,19.43 31.55,21.49 R8.2 | v10.74,17.6 8.46,17.6 7.54,16.69 7.54,16.23 6.4,15.09 4.8,15.09 3.89,14.17 SV1.4
  Bottom 0.254: v29.49,19.43 26.98,19.43 24.46,16.92 15.09,16.92 14.4,17.6 v10.74,17.6
TX
  Top 0.254: IC3.1 8.91,57.15 10.74,58.98 12.12,58.98 13.95,57.15 IC3.3 14.17,57.15 16,55.32 29.95,55.32 30.63,56.01 | 30.63,56.01 30.63,58.29 31.32,58.98 34.98,58.98 36.8,57.15 IC4.4 | 30.63,56.01 33.15,53.49 37.95,53.49 MC1.P$15
TX+
  Top 0.254: CN1.1 51.89,57.84 45.26,57.84 44.58,57.15 R10.2 44.35,57.15 40.69,60.81 37.95,60.81 35.2,63.55 35.2,63.78 34.29,64.69 IC4.6
TX-
  Top 0.254: IC4.7 31.77,64.69 39.32,57.15 R10.1
  Bottom 0.254: CN1.2 51.89,59.89 46.18,59.89 44.58,58.29 40.69,58.29 39.55,57.15 R10.1
USBD+  (via drill 0.61)
  Top 0.254: v51.21,55.09 48.69,52.58 48.69,45.72 50.75,43.66 53.03,43.66 54.41,42.29 54.41,40.69 57.84,37.26 X1.P$3
  Bottom 0.254: X1.P$3 57.84,37.26 57.84,36.12 56.24,34.52 56.24,32.69 53.95,30.4 53.95,29.26 53.03,28.35 50.75,28.35 50.06,27.66 50.06,26.52 51.89,24.69 JP2.3 | v51.21,55.09 53.03,56.92 53.03,64.47 52.35,65.15 41.15,65.15 39.78,66.52 8.46,66.52 7.77,65.84 7.77,62.18 6.63,61.04 6.17,61.04 5.03,59.89 3.89,59.89 JP3.3
USBD-  (via drill 0.61)
  Top 0.254: JP3.2 5.49,57.15 11.43,63.09 25.38,63.09 29.72,67.44 41.6,67.44 43.43,65.61 52.58,65.61 v60.12,58.06 | v69.04,49.15 69.04,41.15 v68.81,40.92 | v64.92,36.12 63.32,36.12 63.09,35.89 61.04,35.89 X1.P$4
  Bottom 0.254: X1.P$4 60.81,35.89 60.81,34.75 59.21,33.15 59.21,32 55.55,28.35 55.55,27.66 55.09,27.2 52.12,27.2 JP2.4 | v69.04,49.15 v60.12,58.06 | v68.81,40.92 68.81,38.18 67.67,37.03 65.84,37.03 v64.92,36.12
VCC  (via drill 0.61)
  Top 0.254: IC4.2 IC4.3 34.75,57.15 36.58,55.32 47.09,55.32 47.78,56.01 48.69,56.01 49.15,55.55 49.15,54.18 v34.98,40.01 | IC4.8 29.03,64.69 29.03,62.18 26.75,59.89 C5.1 | C2.1 8.91,26.75 13.95,31.77 OK1.7 14.17,31.77 14.17,32.23 16,34.06 21.72,34.06 24,31.77 IC2.8 24.23,31.77 26.06,33.6 27.89,33.6 31.09,36.8 31.55,36.8 MC1.P$23 | C1.1 41.6,18.97 39.78,18.97 38.41,17.6 32.69,17.6 31.77,16.69 R8.1 31.55,16.69 29.26,16.69 R7.1 29.03,16.46 29.03,16 27.66,14.63 27.66,9.83 24.23,6.4 IC1.21 | SV1.1 13.72,11.43 18.97,6.17 IC1.19
  Bottom 0.254: 8.69,62.18 6.4,59.89 C4.1 | 8.69,62.18 8.69,64.69 IC3.14 | IC4.2 31.55,57.15 29.03,59.66 26.75,59.66 C5.1 26.52,59.89 25.83,59.89 23.55,62.18 8.69,62.18 | 24,29.49 21.72,27.2 21.72,26.75 C3.1 | 24,29.49 24,31.55 IC2.8 | IC1.19 19.2,6.4 20.8,8 22.4,8 24,6.4 IC1.21 | 24,29.49 26.06,29.49 30.63,24.92 30.63,17.6 31.55,16.69 R8.1 | v34.98,40.01 31.77,36.8 MC1.P$23
VDD  (via drill 0.61)
  Top 0.254: JP1.1 44.58,24.23 44.58,26.52 JP1.3 | 52.12,12.34 54.41,12.34 DZ2.A3 54.63,12.34 57.15,12.34 | 52.12,12.34 52.12,19.43 JP2.1 | 52.12,12.34 DZ2.A4 | v61.27,40.01 62.64,40.01 63.55,40.92 66.06,40.92 69.04,37.95 69.04,13.95 67.44,12.34 DZ1.A2 67.21,12.34 64.92,12.34 DZ1.A3 64.69,12.34 62.41,12.34 DZ1.A4 | v50.29,41.15 v46.18,41.15 | v55.32,41.15 56.69,41.15 57.84,40.01 X1.P$1 | 57.15,12.34 59.66,12.34 DZ2.A1 | 57.15,12.34 DZ2.A2
  Bottom 0.254: JP1.1 44.58,24 46.86,24 51.21,19.66 51.89,19.66 JP2.1 | DZ2.A1 59.89,12.34 62.18,12.34 DZ1.A4 | v61.27,40.01 58.06,40.01 X1.P$1 | DZ1.A1 69.72,12.34 67.44,12.34 DZ1.A2 | v46.18,41.15 44.35,41.15 40.23,37.03 39.55,37.03 MC1.P$20 | v55.32,41.15 v50.29,41.15
XMIDIRX
  Top 0.254: IC2.1 24.23,24 24.23,19.2 S2.3

### Text on the board
Document: 1 | 1 | 1 | PINEAPPLE II NITROGEN 15 / REVISION 1.0.0 (2015)